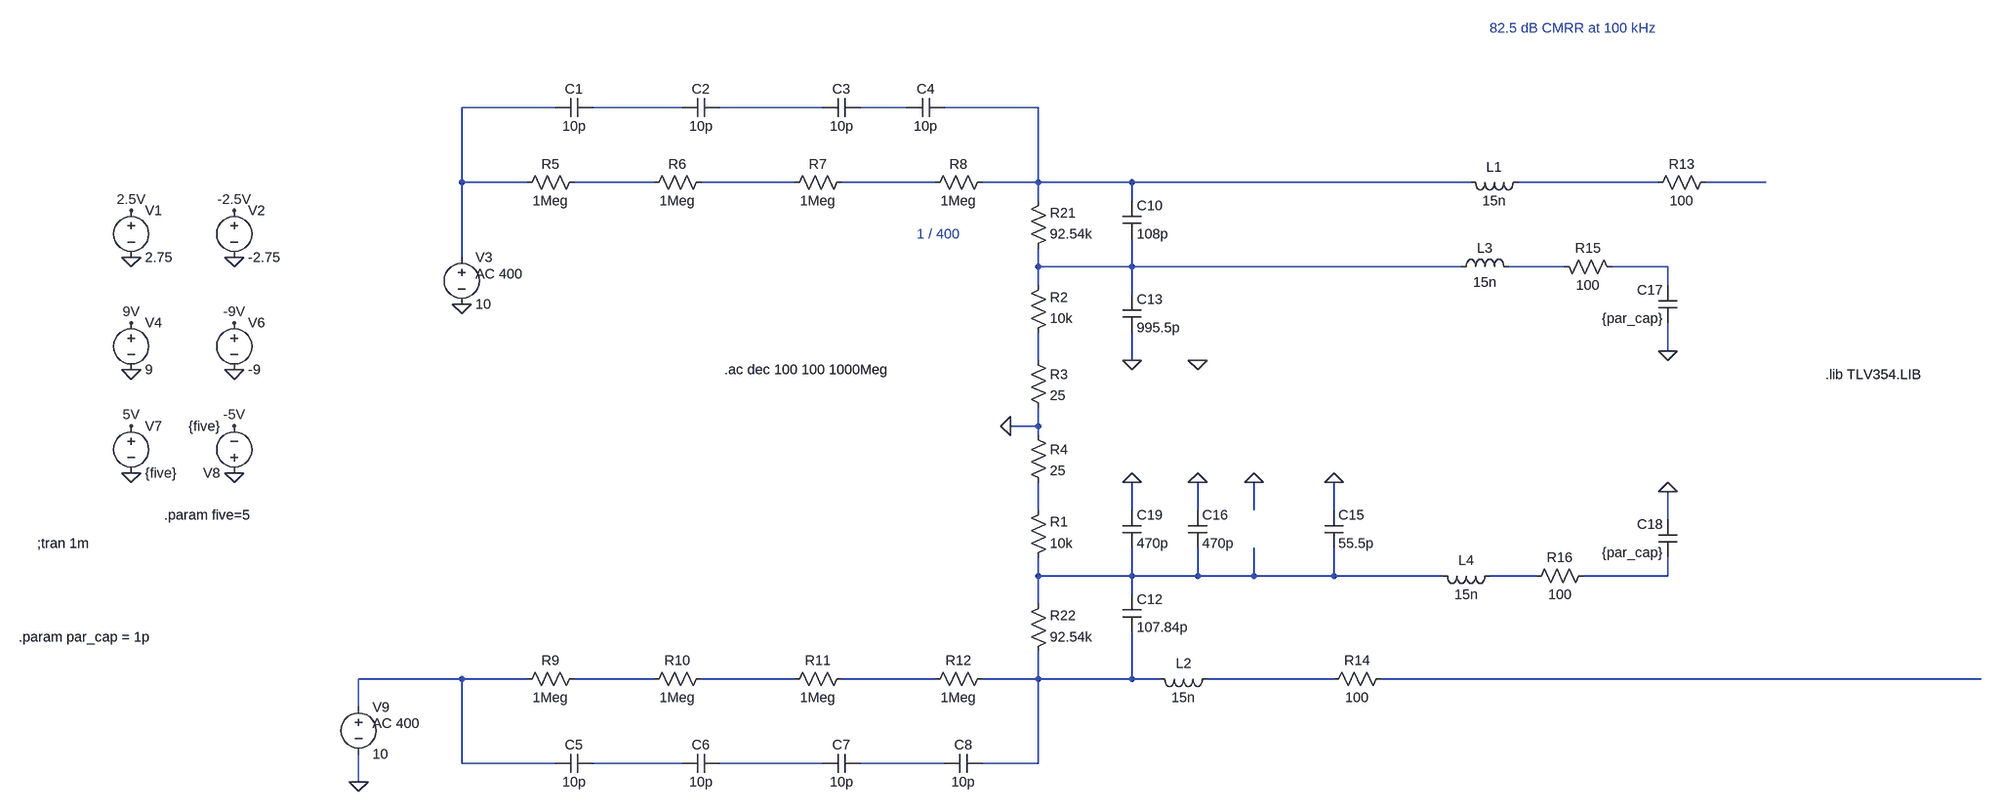
[diagram p0: schematic input_capacitance_trimming.asc]
input_capacitance_trimming.asc, the LTspice schematic file:
Version 4
SHEET 1 7812 2628
WIRE 3936 -432 3776 -432
WIRE 4176 -432 4000 -432
WIRE 4416 -432 4240 -432
WIRE 4560 -432 4480 -432
WIRE 4784 -432 4624 -432
WIRE 3776 -304 3776 -432
WIRE 3888 -304 3776 -304
WIRE 4128 -304 3968 -304
WIRE 4368 -304 4208 -304
WIRE 4608 -304 4448 -304
WIRE 4784 -304 4784 -432
WIRE 4784 -304 4688 -304
WIRE 4944 -304 4784 -304
WIRE 5696 -304 4944 -304
WIRE 6016 -304 5776 -304
WIRE 6240 -304 6096 -304
WIRE 4784 -272 4784 -304
WIRE 4944 -272 4944 -304
WIRE 3776 -176 3776 -304
WIRE 4784 -160 4784 -192
WIRE 4944 -160 4944 -208
WIRE 4944 -160 4784 -160
WIRE 5680 -160 4944 -160
WIRE 5856 -160 5760 -160
WIRE 6032 -160 5936 -160
WIRE 4784 -128 4784 -160
WIRE 6032 -128 6032 -160
WIRE 4944 -112 4944 -160
WIRE 6032 -16 6032 -64
WIRE 4784 0 4784 -48
WIRE 4944 0 4944 -48
WIRE 4784 112 4784 80
WIRE 4784 112 4736 112
WIRE 4784 128 4784 112
WIRE 4784 256 4784 208
WIRE 4944 256 4944 208
WIRE 5056 256 5056 208
WIRE 5152 256 5152 208
WIRE 5312 256 5312 208
WIRE 6032 272 6032 224
WIRE 4784 368 4784 336
WIRE 4944 368 4944 320
WIRE 4944 368 4784 368
WIRE 5056 368 5056 320
WIRE 5056 368 4944 368
WIRE 5152 368 5152 320
WIRE 5152 368 5056 368
WIRE 5312 368 5312 320
WIRE 5312 368 5152 368
WIRE 5648 368 5312 368
WIRE 5808 368 5728 368
WIRE 6032 368 6032 336
WIRE 6032 368 5888 368
WIRE 4944 400 4944 368
WIRE 4784 416 4784 368
WIRE 3776 544 3600 544
WIRE 3888 544 3776 544
WIRE 4128 544 3968 544
WIRE 4368 544 4208 544
WIRE 4608 544 4448 544
WIRE 4784 544 4784 496
WIRE 4784 544 4688 544
WIRE 4944 544 4944 464
WIRE 4944 544 4784 544
WIRE 4992 544 4944 544
WIRE 5312 544 5072 544
WIRE 7344 544 5392 544
WIRE 3600 592 3600 544
WIRE 3776 688 3776 544
WIRE 3936 688 3776 688
WIRE 4176 688 4000 688
WIRE 4416 688 4240 688
WIRE 4624 688 4480 688
WIRE 4784 688 4784 544
WIRE 4784 688 4688 688
WIRE 3600 720 3600 672
FLAG -80 -176 0
FLAG -80 -256 2.5V
FLAG 96 -176 0
FLAG 96 -256 -2.5V
FLAG -80 16 0
FLAG -80 -64 9V
FLAG 96 16 0
FLAG 96 -64 -9V
FLAG -80 192 0
FLAG -80 112 5V
FLAG 96 192 0
FLAG 96 112 -5V
FLAG 4736 112 0
FLAG 5056 0 0
FLAG 4944 0 0
FLAG 6032 -16 0
FLAG 6032 224 0
FLAG 5152 208 0
FLAG 5312 208 0
FLAG 5056 208 0
FLAG 4944 208 0
FLAG 3600 720 0
FLAG 3776 -96 0
SYMBOL voltage -80 -272 R0
SYMATTR InstName V1
SYMATTR Value 2.75
SYMBOL voltage 96 -272 R0
SYMATTR InstName V2
SYMATTR Value -2.75
SYMBOL voltage -80 -80 R0
SYMATTR InstName V4
SYMATTR Value 9
SYMBOL voltage 96 -80 R0
SYMATTR InstName V6
SYMATTR Value -9
SYMBOL voltage -80 96 R0
SYMATTR InstName V7
SYMATTR Value {five}
SYMBOL voltage 96 208 R180
WINDOW 123 0 0 Left 0
WINDOW 39 0 0 Left 0
SYMATTR InstName V8
SYMATTR Value {five}
SYMBOL res 4768 352 M180
WINDOW 0 36 76 Left 2
WINDOW 3 36 40 Left 2
SYMATTR InstName R1
SYMATTR Value 10k
SYMBOL cap 4000 -448 R90
WINDOW 0 0 32 VBottom 2
WINDOW 3 32 32 VTop 2
SYMATTR InstName C1
SYMATTR Value 10p
SYMBOL cap 4240 -448 R90
WINDOW 0 0 32 VBottom 2
WINDOW 3 32 32 VTop 2
SYMATTR InstName C2
SYMATTR Value 10p
SYMBOL cap 4480 -448 R90
WINDOW 0 0 32 VBottom 2
WINDOW 3 32 32 VTop 2
SYMATTR InstName C3
SYMATTR Value 10p
SYMBOL cap 4624 -448 R90
WINDOW 0 0 32 VBottom 2
WINDOW 3 32 32 VTop 2
SYMATTR InstName C4
SYMATTR Value 10p
SYMBOL cap 4000 672 R90
WINDOW 0 0 32 VBottom 2
WINDOW 3 32 32 VTop 2
SYMATTR InstName C5
SYMATTR Value 10p
SYMBOL cap 4240 672 R90
WINDOW 0 0 32 VBottom 2
WINDOW 3 32 32 VTop 2
SYMATTR InstName C6
SYMATTR Value 10p
SYMBOL cap 4480 672 R90
WINDOW 0 0 32 VBottom 2
WINDOW 3 32 32 VTop 2
SYMATTR InstName C7
SYMATTR Value 10p
SYMBOL cap 4688 672 R90
WINDOW 0 0 32 VBottom 2
WINDOW 3 32 32 VTop 2
SYMATTR InstName C8
SYMATTR Value 10p
SYMBOL res 4768 -32 M180
WINDOW 0 36 76 Left 2
WINDOW 3 36 40 Left 2
SYMATTR InstName R2
SYMATTR Value 10k
SYMBOL voltage 3776 -192 R0
WINDOW 123 24 44 Left 2
WINDOW 39 0 0 Left 0
SYMATTR Value2 AC 400
SYMATTR InstName V3
SYMATTR Value 10
SYMBOL res 4768 -16 R0
SYMATTR InstName R3
SYMATTR Value 25
SYMBOL res 4768 112 R0
SYMATTR InstName R4
SYMATTR Value 25
SYMBOL cap 4928 -112 R0
SYMATTR InstName C13
SYMATTR Value 995.5p
SYMBOL ind 5792 -320 R90
WINDOW 0 5 56 VBottom 2
WINDOW 3 32 56 VTop 2
SYMATTR InstName L1
SYMATTR Value 15n
SYMBOL res 3984 -320 R90
WINDOW 0 0 56 VBottom 2
WINDOW 3 32 56 VTop 2
SYMATTR InstName R5
SYMATTR Value 1Meg
SYMBOL res 4224 -320 R90
WINDOW 0 0 56 VBottom 2
WINDOW 3 32 56 VTop 2
SYMATTR InstName R6
SYMATTR Value 1Meg
SYMBOL res 4464 -320 R90
WINDOW 0 0 56 VBottom 2
WINDOW 3 32 56 VTop 2
SYMATTR InstName R7
SYMATTR Value 1Meg
SYMBOL res 4704 -320 R90
WINDOW 0 0 56 VBottom 2
WINDOW 3 32 56 VTop 2
SYMATTR InstName R8
SYMATTR Value 1Meg
SYMBOL res 3984 528 R90
WINDOW 0 0 56 VBottom 2
WINDOW 3 32 56 VTop 2
SYMATTR InstName R9
SYMATTR Value 1Meg
SYMBOL res 4224 528 R90
WINDOW 0 0 56 VBottom 2
WINDOW 3 32 56 VTop 2
SYMATTR InstName R10
SYMATTR Value 1Meg
SYMBOL res 4464 528 R90
WINDOW 0 0 56 VBottom 2
WINDOW 3 32 56 VTop 2
SYMATTR InstName R11
SYMATTR Value 1Meg
SYMBOL res 4704 528 R90
WINDOW 0 0 56 VBottom 2
WINDOW 3 32 56 VTop 2
SYMATTR InstName R12
SYMATTR Value 1Meg
SYMBOL ind 5088 528 R90
WINDOW 0 5 56 VBottom 2
WINDOW 3 32 56 VTop 2
SYMATTR InstName L2
SYMATTR Value 15n
SYMBOL res 6112 -320 R90
WINDOW 0 0 56 VBottom 2
WINDOW 3 32 56 VTop 2
SYMATTR InstName R13
SYMATTR Value 100
SYMBOL res 5408 528 R90
WINDOW 0 0 56 VBottom 2
WINDOW 3 32 56 VTop 2
SYMATTR InstName R14
SYMATTR Value 100
SYMBOL ind 5776 -144 M270
WINDOW 0 32 56 VTop 2
WINDOW 3 5 56 VBottom 2
SYMATTR InstName L3
SYMATTR Value 15n
SYMBOL res 5952 -144 M270
WINDOW 0 32 56 VTop 2
WINDOW 3 0 56 VBottom 2
SYMATTR InstName R15
SYMATTR Value 100
SYMBOL cap 6048 -128 M0
SYMATTR InstName C17
SYMATTR Value {par_cap}
SYMBOL ind 5744 352 R90
WINDOW 0 5 56 VBottom 2
WINDOW 3 32 56 VTop 2
SYMATTR InstName L4
SYMATTR Value 15n
SYMBOL res 5904 352 R90
WINDOW 0 0 56 VBottom 2
WINDOW 3 32 56 VTop 2
SYMATTR InstName R16
SYMATTR Value 100
SYMBOL cap 6048 336 R180
WINDOW 0 24 56 Left 2
WINDOW 3 24 8 Left 2
SYMATTR InstName C18
SYMATTR Value {par_cap}
SYMBOL res 4768 -176 M180
WINDOW 0 36 76 Left 2
WINDOW 3 36 40 Left 2
SYMATTR InstName R21
SYMATTR Value 92.54k
SYMBOL res 4768 512 M180
WINDOW 0 36 76 Left 2
WINDOW 3 36 40 Left 2
SYMATTR InstName R22
SYMATTR Value 92.54k
SYMBOL cap 5296 320 M180
WINDOW 0 24 56 Left 2
WINDOW 3 24 8 Left 2
SYMATTR InstName C15
SYMATTR Value 55.5p
SYMBOL cap 5040 320 M180
WINDOW 0 24 56 Left 2
WINDOW 3 24 8 Left 2
SYMATTR InstName C16
SYMATTR Value 470p
SYMBOL cap 4928 320 M180
WINDOW 0 24 56 Left 2
WINDOW 3 24 8 Left 2
SYMATTR InstName C19
SYMATTR Value 470p
SYMBOL cap 4928 -272 R0
SYMATTR InstName C10
SYMATTR Value 108p
SYMBOL cap 4928 400 R0
SYMATTR InstName C12
SYMATTR Value 107.84p
SYMBOL voltage 3600 576 R0
WINDOW 123 24 44 Left 2
WINDOW 39 0 0 Left 0
SYMATTR Value2 AC 400
SYMATTR InstName V9
SYMATTR Value 10
TEXT -240 312 Left 2 !;tran 1m
TEXT -24 264 Left 2 !.param five=5
TEXT -272 472 Left 2 !.param par_cap = 1p
TEXT 4576 -216 Left 2 ;1 / 400
TEXT 5728 -568 Left 2 ;82.5 dB CMRR at 100 kHz
TEXT 4248 16 Left 2 !.ac dec 100 100 1000Meg
TEXT 6448 24 Left 2 !.lib TLV354.LIB

The netlist it stands for:
* input_capacitance_trimming.asc
V1 2.5V 0 2.75
V2 -2.5V 0 -2.75
V4 9V 0 9
V6 -9V 0 -9
V7 5V 0 {five}
V8 0 -5V {five}
R1 N016 N015 10k
C1 N002 N001 10p
C2 N003 N002 10p
C3 N004 N003 10p
C4 N005 N004 10p
C5 N026 N019 10p
C6 N027 N026 10p
C7 N028 N027 10p
C8 N023 N028 10p
R2 N014 N011 10k
V3 N001 0 10 AC 400
R3 N014 0 25
R4 0 N015 25
C13 N011 0 995.5p
L1 N009 N005 15n
R5 N006 N001 1Meg
R6 N007 N006 1Meg
R7 N008 N007 1Meg
R8 N005 N008 1Meg
R9 N020 N019 1Meg
R10 N021 N020 1Meg
R11 N022 N021 1Meg
R12 N023 N022 1Meg
L2 N024 N023 15n
R13 N010 N009 100
R14 N025 N024 100
L3 N012 N011 15n
R15 N013 N012 100
C17 N013 0 {par_cap}
L4 N017 N016 15n
R16 N018 N017 100
C18 N018 0 {par_cap}
R21 N011 N005 92.54k
R22 N023 N016 92.54k
C15 N016 0 55.5p
C16 N016 0 470p
C19 N016 0 470p
C10 N005 N011 108p
C12 N016 N023 107.84p
V9 N019 0 10 AC 400
;tran 1m
.param five=5
.param par_cap = 1p
* 1 / 400
* 82.5 dB CMRR at 100 kHz
.ac dec 100 100 1000Meg
.lib TLV354.LIB
.backanno
.end